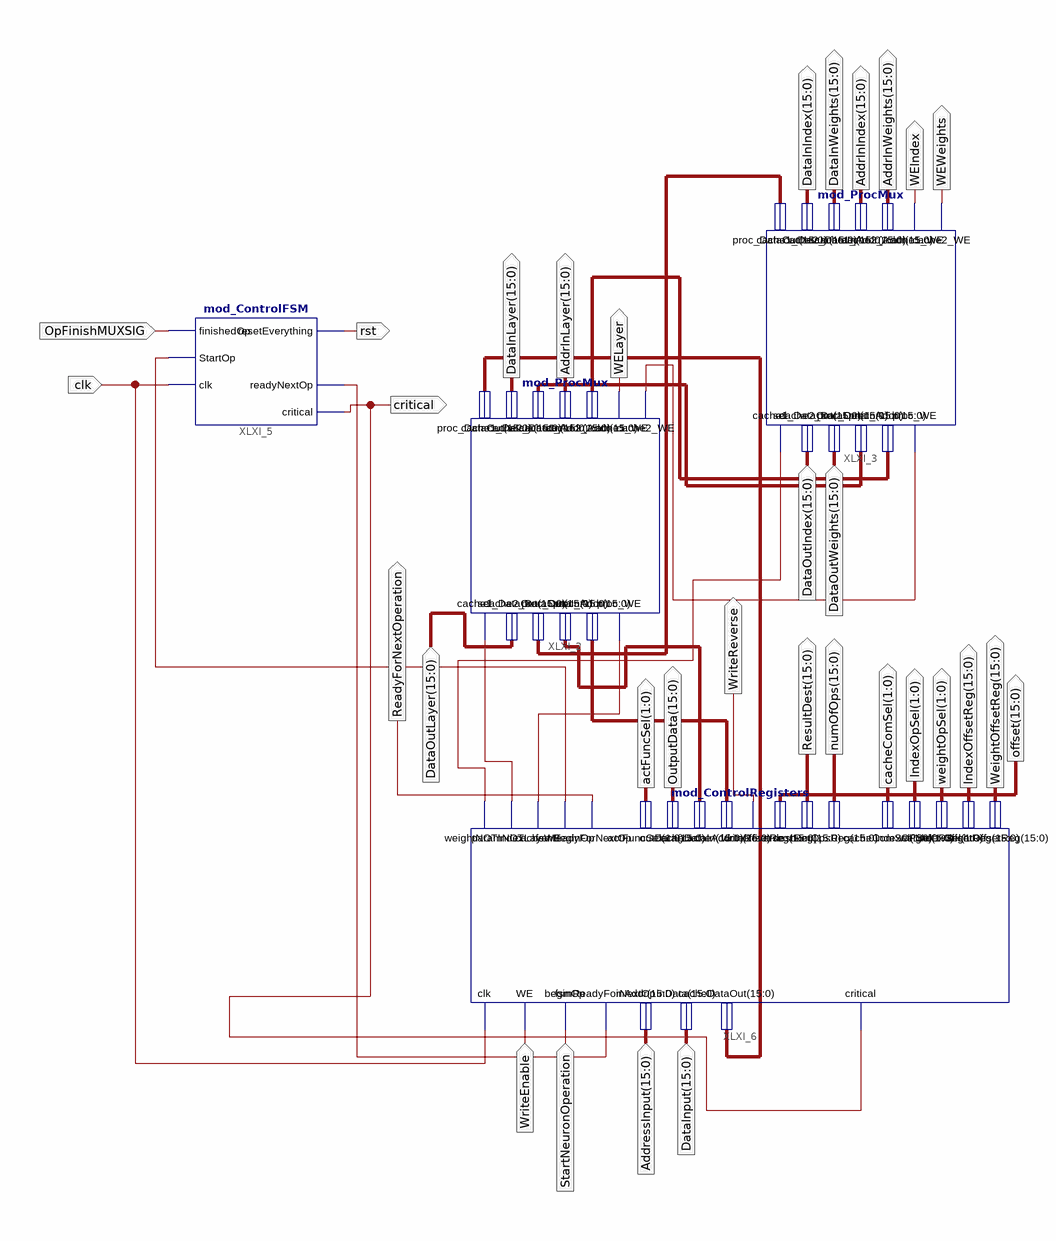
[diagram p0: schematic sheet 1]
// Xilinx ISE schematic mod_ControllerNEW.sch (spartan3e) as structural Verilog: 4 symbols, 32 ports
module mod_ControllerNEW (
  input  WriteEnable,
  input  StartNeuronOperation,
  input  [15:0] AddressInput,
  input  [15:0] DataInput,
  input  [15:0] DataOutWeights,
  input  [15:0] DataOutIndex,
  input  [15:0] DataOutLayer,
  input  OpFinishMUXSIG,
  input  clk,
  output critical,
  output [1:0] weightOpSel,
  output [1:0] actFuncSel,
  output [15:0] OutputData,
  output WriteReverse,
  output [15:0] offset,
  output [15:0] ResultDest,
  output [15:0] numOfOps,
  output [1:0] cacheComSel,
  output [1:0] IndexOpSel,
  output WEWeights,
  output WEIndex,
  output [15:0] AddrInWeights,
  output [15:0] AddrInIndex,
  output [15:0] DataInWeights,
  output [15:0] DataInIndex,
  output WELayer,
  output [15:0] AddrInLayer,
  output [15:0] DataInLayer,
  output ReadyForNextOperation,
  output rst,
  output [15:0] IndexOffsetReg,
  output [15:0] WeightOffsetReg
);

  wire ReadyForNextOp, StartOperation, XLXN_9, XLXN_50, XLXN_76, XLXN_77;
  wire [15:0] XLXN_2, XLXN_7, XLXN_25, XLXN_26, XLXN_28, XLXN_48;

  mod_ControlRegisters XLXI_6 (
    .WE(WriteEnable), .beginOp(StartNeuronOperation), .fsmReadyForNextOp(ReadyForNextOp),
    .critical(critical), .clk(clk), .inAddr(AddressInput), .inData(DataInput), .cacheDataOut(XLXN_7),
    .weightNOTIndex(XLXN_76), .paramNOTLayer(XLXN_9), .writeReverse(WriteReverse), .cacheWE(XLXN_50),
    .fsmBeginOp(StartOperation), .readyForNextOp(ReadyForNextOperation), .cacheComSel(cacheComSel),
    .actFuncSel(actFuncSel), .weightOPSel(weightOpSel), .indexOPSel(IndexOpSel), .outData(OutputData),
    .cacheDataIn(XLXN_48), .cacheAddrIn(XLXN_2), .indexOffsetReg(IndexOffsetReg),
    .weightOffsetReg(WeightOffsetReg), .offsetReg(offset), .destReg(ResultDest), .numOpsReg(numOfOps));
  mod_ControlFSM XLXI_5 (
    .finishedOp(OpFinishMUXSIG), .StartOp(StartOperation), .clk(clk), .resetEverything(rst),
    .readyNextOp(ReadyForNextOp), .critical(critical));
  mod_ProcMux XLXI_3 (
    .sel(XLXN_76), .cache1_DataOut(DataOutIndex), .cache2_DataOut(DataOutWeights), .proc_DataIn(XLXN_25),
    .proc_Addr(XLXN_26), .proc_WE(XLXN_77), .proc_DataOut(XLXN_28), .cache1_DataIn(DataInIndex),
    .cache2_DataIn(DataInWeights), .cache1_Addr(AddrInIndex), .cache2_Addr(AddrInWeights),
    .cache1_WE(WEIndex), .cache2_WE(WEWeights));
  mod_ProcMux XLXI_2 (
    .sel(XLXN_9), .cache1_DataOut(DataOutLayer), .cache2_DataOut(XLXN_28), .proc_DataIn(XLXN_48),
    .proc_Addr(XLXN_2), .proc_WE(XLXN_50), .proc_DataOut(XLXN_7), .cache1_DataIn(DataInLayer),
    .cache2_DataIn(XLXN_25), .cache1_Addr(AddrInLayer), .cache2_Addr(XLXN_26), .cache1_WE(WELayer),
    .cache2_WE(XLXN_77));
endmodule
